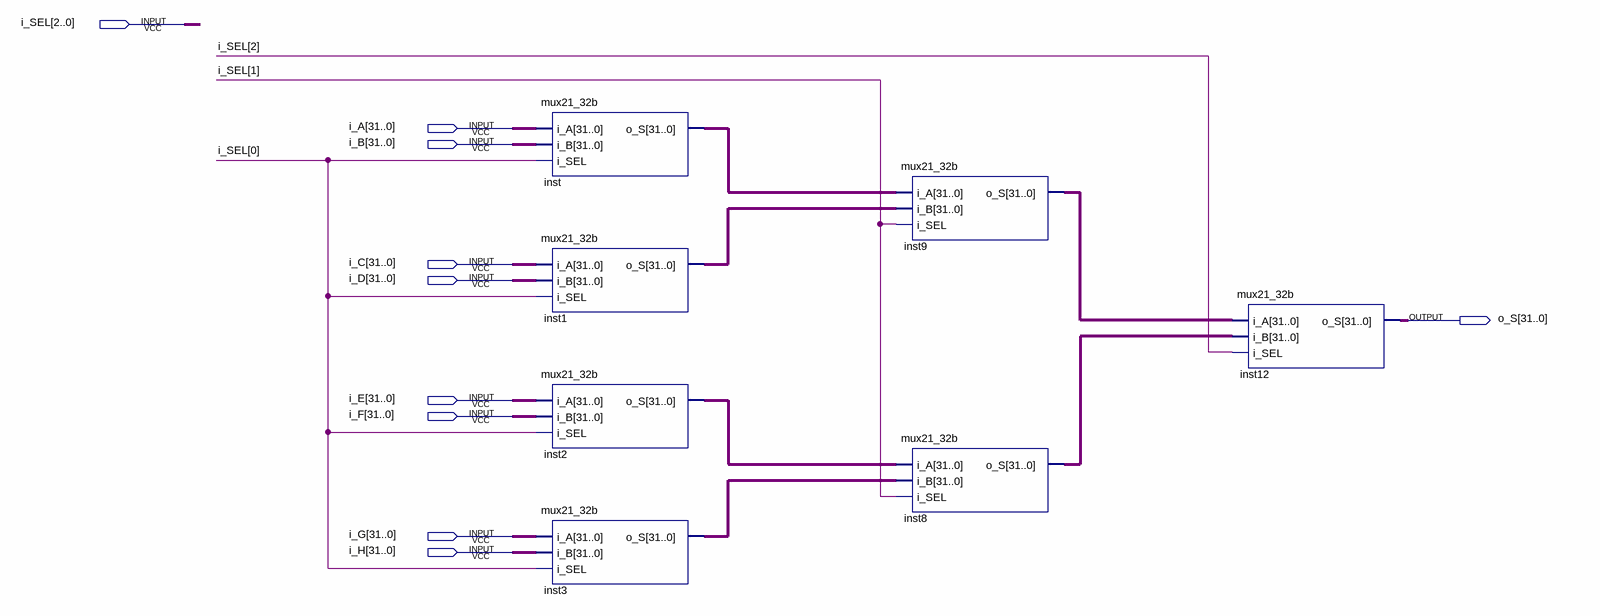
[diagram p0: schematic sheet]
// Quartus schematic mux81_32b.bdf as structural Verilog: 7 symbols, 10 pins
module mux81_32b (
  input  [2:0] i_SEL,
  input  [31:0] i_A,
  input  [31:0] i_B,
  input  [31:0] i_C,
  input  [31:0] i_D,
  input  [31:0] i_E,
  input  [31:0] i_F,
  input  [31:0] i_G,
  input  [31:0] i_H,
  output [31:0] o_S
);

  wire [31:0] inst1_o_s, inst2_o_s, inst3_o_s, inst8_o_s, inst9_o_s, inst_o_s;

  mux21_32b inst (.i_A(i_A), .i_B(i_B), .i_SEL(i_SEL[0]), .o_S(inst_o_s));
  mux21_32b inst1 (.i_A(i_C), .i_B(i_D), .i_SEL(i_SEL[0]), .o_S(inst1_o_s));
  mux21_32b inst2 (.i_A(i_E), .i_B(i_F), .i_SEL(i_SEL[0]), .o_S(inst2_o_s));
  mux21_32b inst3 (.i_A(i_G), .i_B(i_H), .i_SEL(i_SEL[0]), .o_S(inst3_o_s));
  mux21_32b inst9 (.i_A(inst_o_s), .i_B(inst1_o_s), .i_SEL(i_SEL[1]), .o_S(inst9_o_s));
  mux21_32b inst8 (.i_A(inst2_o_s), .i_B(inst3_o_s), .i_SEL(i_SEL[1]), .o_S(inst8_o_s));
  mux21_32b inst12 (.i_A(inst9_o_s), .i_B(inst8_o_s), .i_SEL(i_SEL[2]), .o_S(o_S));
endmodule
